# EAGLE design cmv_s (EAGLE 9.6.2)
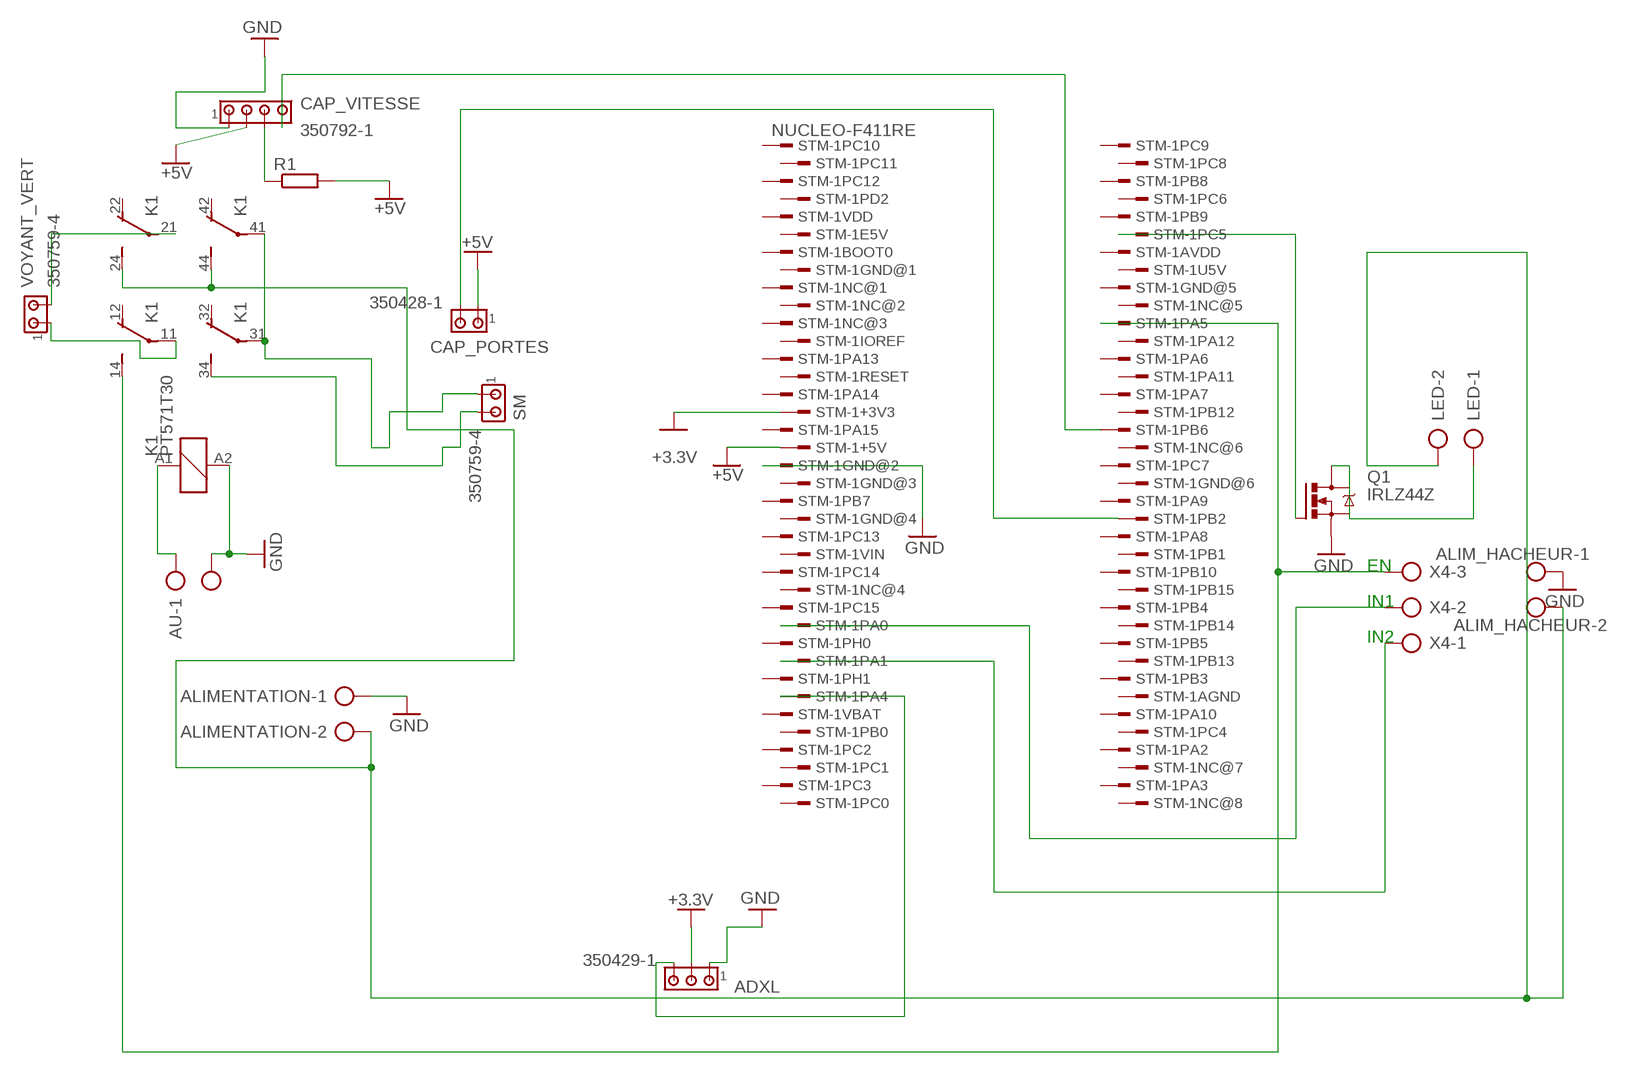
[diagram p0: schematic, sheet 1]

## Parts
ADXL  350429-1  [350429-1]
ALIM_HACHEUR  AK300/2  [AK300/2]
ALIMENTATION  AK300/2  [AK300/2]
AU  AK300/2  [AK300/2]
CAP_PORTES  350428-1  [350428-1]
CAP_VITESSE  350792-1  [350792-1]
K1  PT571T30  [PT-4]
LED  AK300/2  [AK300/2]
Q1  IRLZ44Z  [TO220BH]
R1  R-EU_0204/7  [0204/7]
SM  350759-4  [350759-4]
STM-1  NUCLEO-F411RE  [CONN_STM32_NUCLEO]
VOYANT_VERT  350759-4  [350759-4]
X4  AK300/3  [AK300/3]

## Nets
+3.3V: ADXL.2 STM-1.16
+5V: CAP_PORTES.1 CAP_VITESSE.2 R1.2 STM-1.18
GND: ADXL.1 ALIM_HACHEUR.1 ALIMENTATION.1 AU.2 CAP_VITESSE.1 K1.A2 Q1.S STM-1.19
N$1: AU.1 K1.A1
N$2: K1.34(4:S) SM.2
N$3: K1.11(2:P) VOYANT_VERT.1
N$4: LED.1 Q1.D
N$5: CAP_VITESSE.3 R1.1
N$6: K1.21(3:P) VOYANT_VERT.2
N$7: CAP_PORTES.2 STM-1.60
N$8: K1.31(4:P) K1.41(5:P) SM.1
N$9: CAP_VITESSE.4 STM-1.55
N$10: ADXL.3 STM-1.32
N$11: Q1.G STM-1.44
N$12: ALIM_HACHEUR.2 ALIMENTATION.2 K1.24(3:S) K1.44(5:S) LED.2
N$13: K1.14(2:S) STM-1.49 X4.3
N$14: STM-1.28 X4.2
N$15: STM-1.30 X4.1
Unconnected: K1.12(2:O) K1.22(3:O) K1.32(4:O) K1.42(5:O) STM-1.1 STM-1.2 STM-1.3 STM-1.4 STM-1.5 STM-1.6 STM-1.7 STM-1.8 STM-1.9 STM-1.10 STM-1.11 STM-1.12 STM-1.13 STM-1.14 STM-1.15 STM-1.17 STM-1.20 STM-1.21 STM-1.22 STM-1.23 STM-1.24 STM-1.25 STM-1.26 STM-1.27 STM-1.29 STM-1.31 STM-1.33 STM-1.34 STM-1.35 STM-1.36 STM-1.37 STM-1.38 STM-1.39 STM-1.40 STM-1.41 STM-1.42 STM-1.43 STM-1.45 STM-1.46 STM-1.47 STM-1.48 STM-1.50 STM-1.51 STM-1.52 STM-1.53 STM-1.54 STM-1.56 STM-1.57 STM-1.58 STM-1.59 STM-1.61 STM-1.62 STM-1.63 STM-1.64 STM-1.65 STM-1.66 STM-1.67 STM-1.68 STM-1.69 STM-1.70 STM-1.71 STM-1.72 STM-1.73 STM-1.74 STM-1.75 STM-1.76

## Notes on the sheet
- EN
- IN1
- IN2

## Library data of the parts
ADXL = con-amp:350429-1: Universal MATE-N-LOK .250" Centerline, 600 V, 19 - 36 A max Source: http://catalog.tycoelectronics.com/ .. ENG_CD_350429_Y.pdf
ALIM_HACHEUR ALIMENTATION AU LED = con-ptr500:AK300/2: CONNECTOR; OC_FARNELL: unknown; OC_NEWARK: unknown
CAP_PORTES = con-amp:350428-1: Universal MATE-N-LOK .250" Centerline, 600 V, 19 - 36 A max Source: http://catalog.tycoelectronics.com/ .. ENG_CD_350428_Y.pdf
CAP_VITESSE = con-amp:350792-1: Universal MATE-N-LOK .250" Centerline, 600 V, 19 - 36 A max Source: http://catalog.tycoelectronics.com/ .. ENG_CD_350792_R.pdf
K1 = relay:PT5*: Miniature Relay SCHRACK 2 pole 12 A, 3 pole 10 A or 4 pole 6 A DC- or AC-coil Source: http://www.schrack.com/.. 5823.pdf Socked 78604 Source: http://www.schrack.com/.. 5836.pdf; OC_FARNELL: unknown; OC_NEWARK: unknown
Q1 = transistor-power:IRLZ44Z: N-Channel HEXFET® Power MOSFET Logic Level AUTOMOTIVE MOSFET Source: http://www.irf.com/product-info/datasheets/data/irlz44zpbf.pdf
R1 = rcl:R-EU_: RESISTOR, European symbol; SPICEPREFIX: R
SM VOYANT_VERT = con-amp:350759-4: Universal MATE-N-LOK .250" Centerline, 600 V, 19 - 36 A max Source: http://catalog.tycoelectronics.com/ .. ENG_CD_350759_R.pdf
STM-1 = prj-ips-jmb:NUCLEO-F411RE
X4 = con-ptr500:AK300/3: CONNECTOR; OC_FARNELL: unknown; OC_NEWARK: unknown

## Board
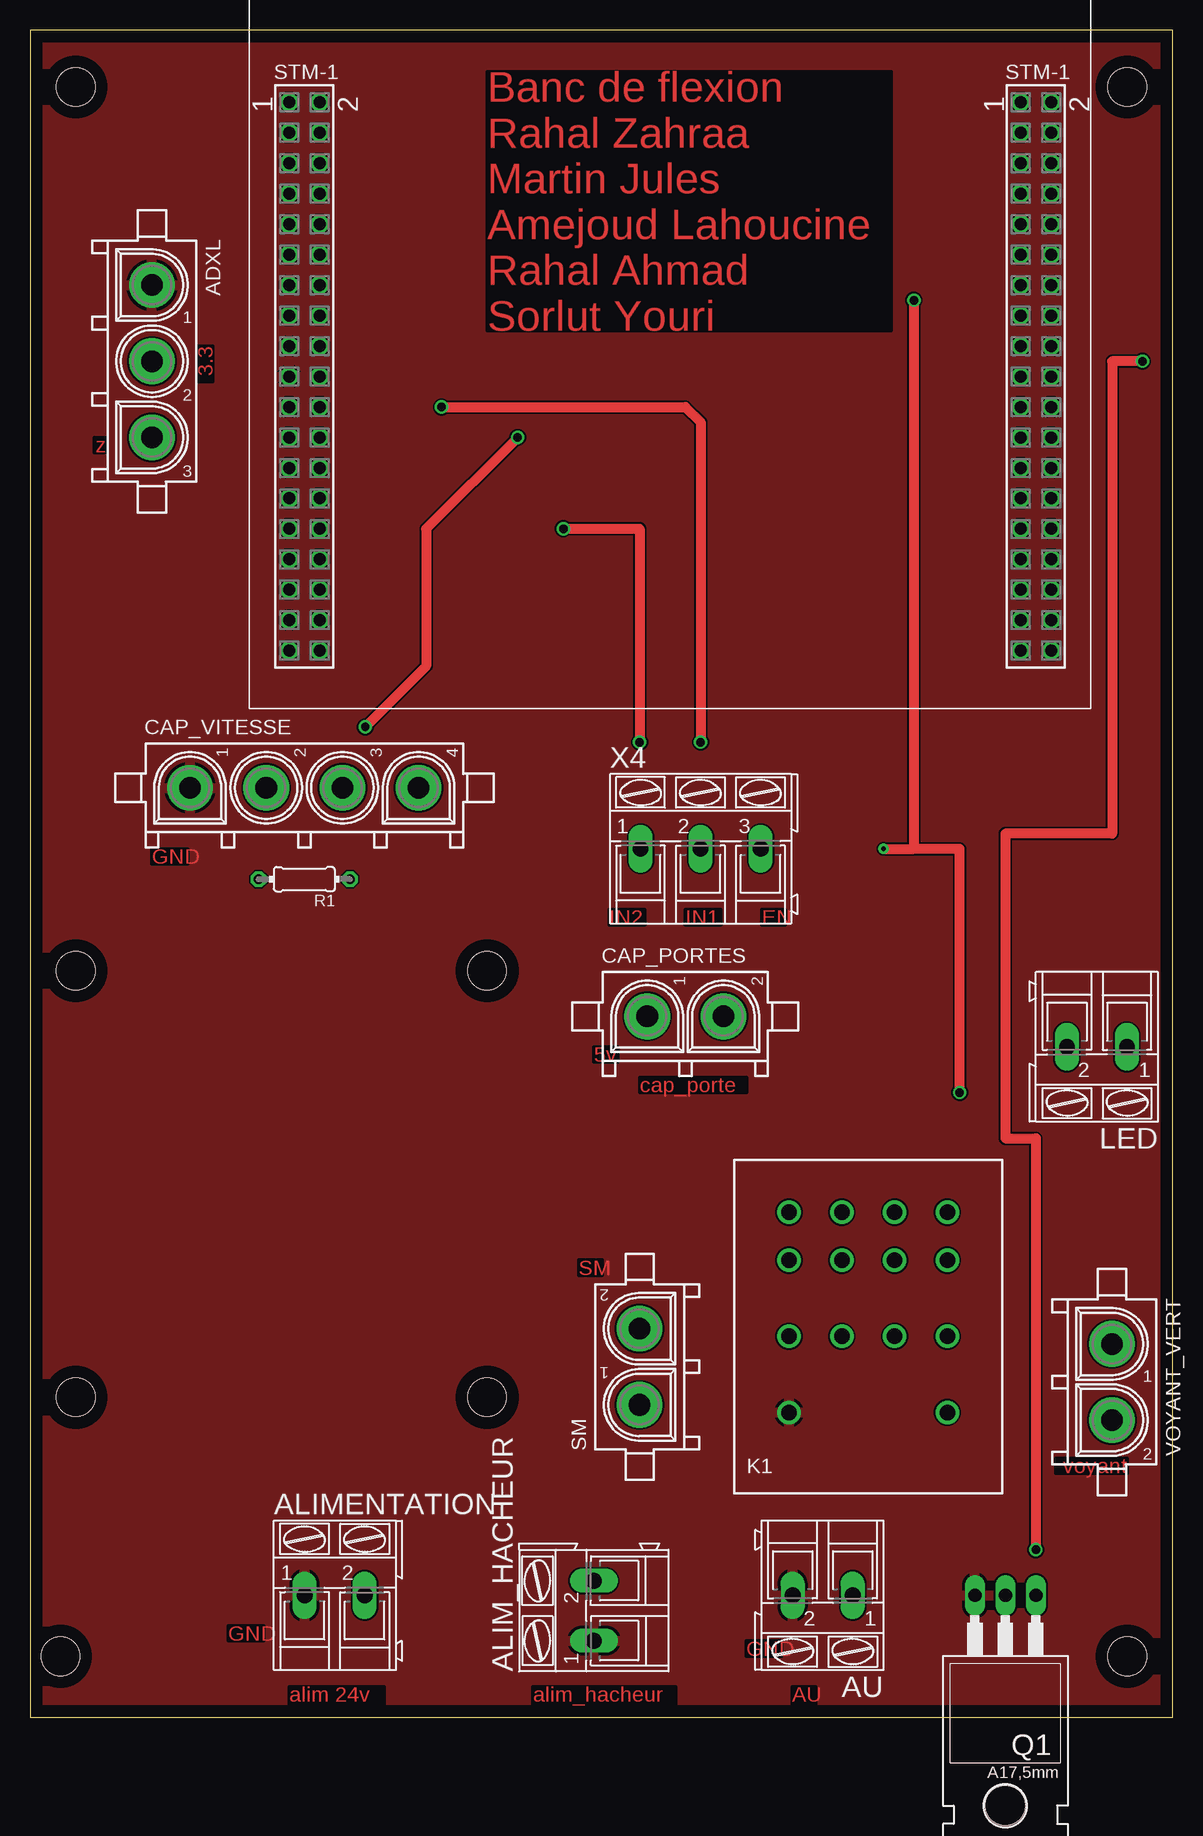
[diagram p1: board, top side]
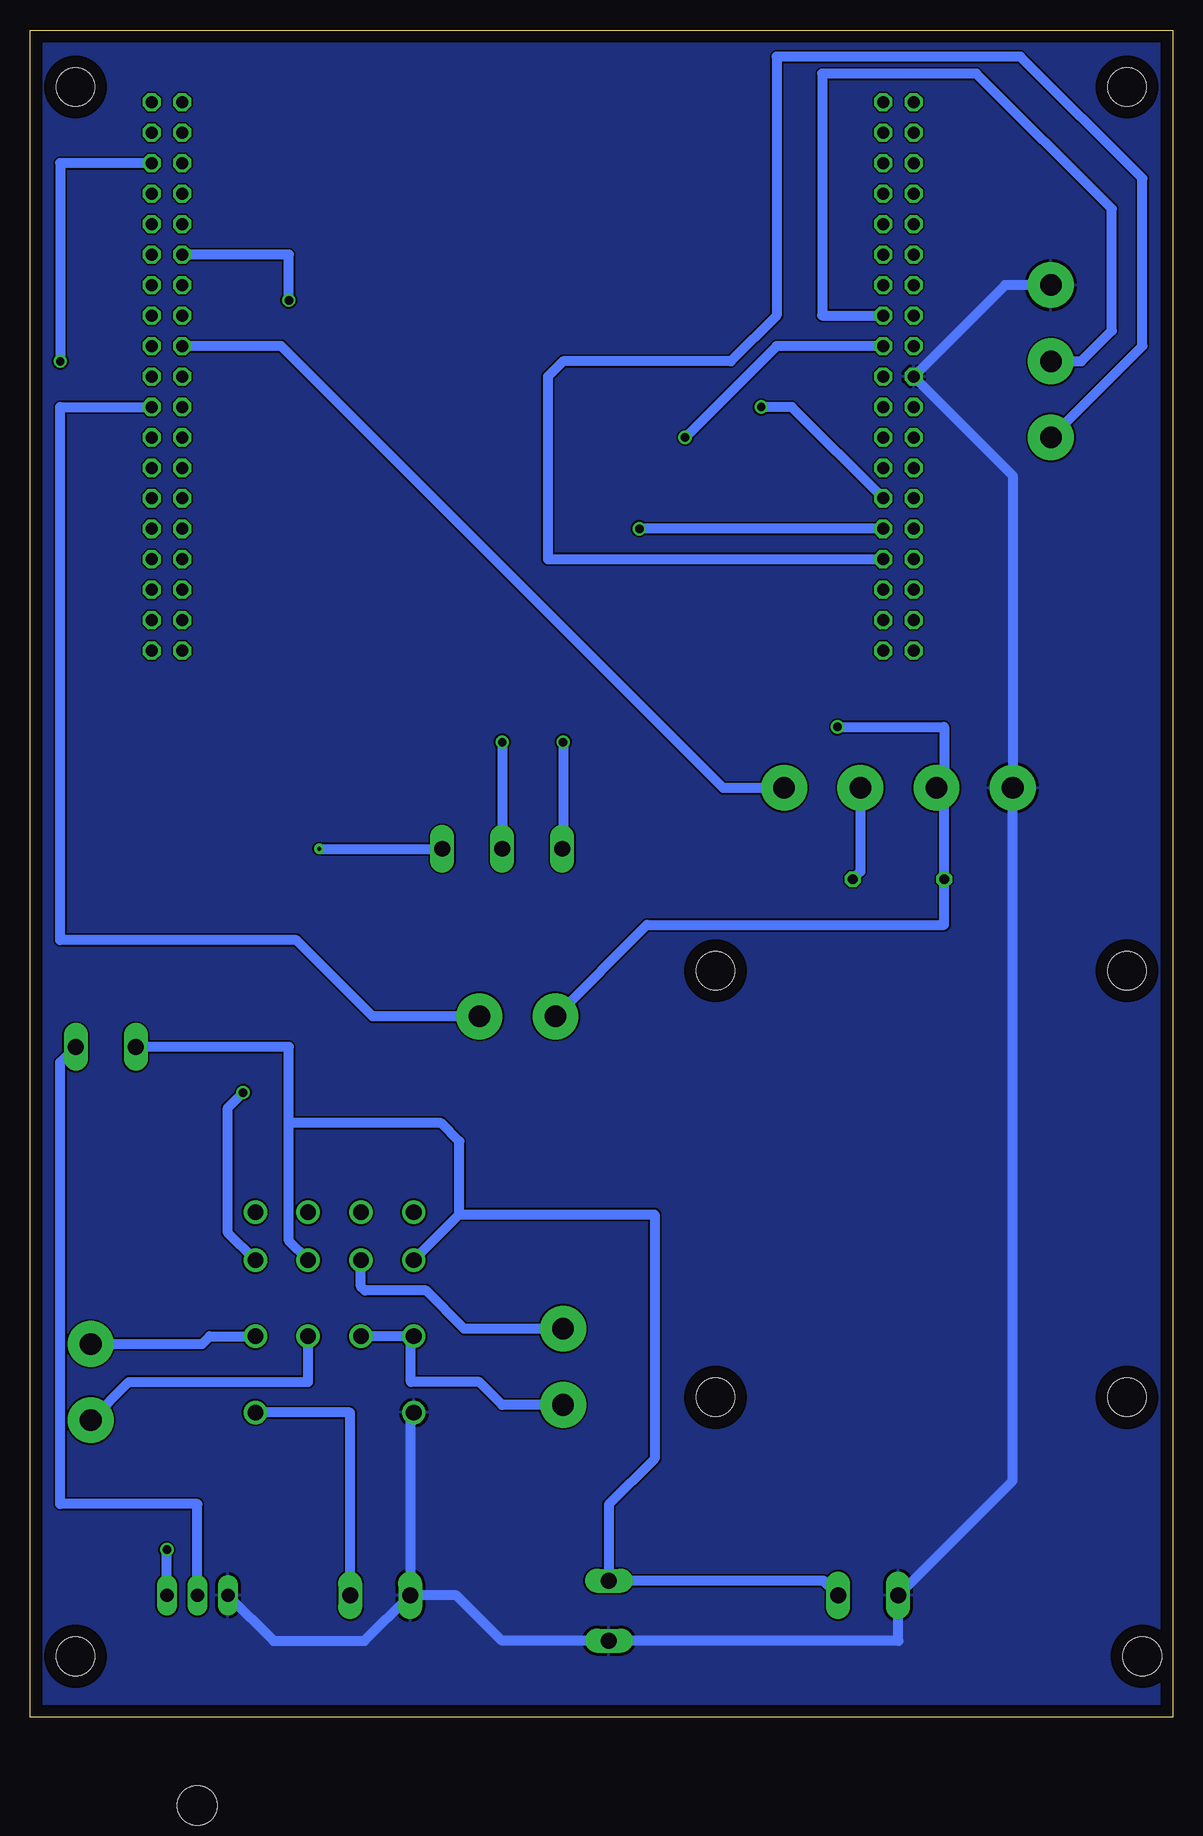
[diagram p2: board, bottom side, seen from below]

Size 95.23 x 140.64 mm. Coordinates in mm from the lower left corner, seen from the top.
Outline: 0,0 95.23,0 95.23,140.64 0,140.64 0,0
Copper layers (1*16): Top 0.035mm / dielectric 1.5mm / Bottom 0.035mm
Design rules "default": minimum track width 6mil, minimum drill 0.35mm, track to track 6mil, track to pad 6mil, pad to pad 6mil, via to via 6mil, smd to smd 6mil, copper to edge 40mil, drill to drill 6mil, minimum pad ring 10mil, minimum via ring 8mil, stop-mask expansion 4mil, vias tented up to drill 0mil, thermal gap 10mil
Holes 3.2 mm at 38.1,62.23 3.81,62.23 3.81,26.67 38.1,26.67 3.81,135.89 2.54,5.08 91.44,135.89 91.44,5.08

### Footprints (pad centres in the part's own frame; a part is rotated, then mirrored left to right if it is on the bottom)
350429-1 = drill 1.8 pad 3.81: 1 -6.35,0; 2 0,0; 3 6.35,0
AK300/2 = drill 1.321 long: 1 -2.515,0; 2 2.489,0
350428-1 = drill 1.8 pad 3.81: 1 -3.175,0; 2 3.175,0
350792-1 = drill 1.8 pad 3.81: 1 -9.525,0; 2 -3.175,0; 3 3.175,0; 4 9.525,0
PT-4 = drill 1.3: 11 6.6,6.35; 12 6.6,16.7; 14 6.6,12.7; 21 2.2,6.35; 22 2.2,16.7; 24 2.2,12.7; 31 -2.2,6.35; 32 -2.2,16.7; 34 -2.2,12.7; 41 -6.6,6.35; 42 -6.6,16.7; 44 -6.6,12.7; A1 6.6,0; A2 -6.6,0
TO220BH = drill 1.118 long: D 0,-6.35; G -2.54,-6.35; S 2.54,-6.35 | hole 3.302: 0,11.176
0204/7 = drill 0.813 octagon: 1 -3.81,0; 2 3.81,0
350759-4 = drill 1.8 pad 3.81: 1 -3.175,0; 2 3.175,0
CONN_STM32_NUCLEO = drill 1 pad 1.5 octagon: 1 -1.27,22.86; 2 1.27,22.86; 3 -1.27,20.32; 4 1.27,20.32; 5 -1.27,17.78; 6 1.27,17.78; 7 -1.27,15.24; 8 1.27,15.24; 9 -1.27,12.7; 10 1.27,12.7; 11 -1.27,10.16; 12 1.27,10.16; 13 -1.27,7.62; 14 1.27,7.62; 15 -1.27,5.08; 16 1.27,5.08; 17 -1.27,2.54; 18 1.27,2.54; 19 -1.27,0; 20 1.27,0; 21 -1.27,-2.54; 22 1.27,-2.54; 23 -1.27,-5.08; 24 1.27,-5.08; 25 -1.27,-7.62; 26 1.27,-7.62; 27 -1.27,-10.16; 28 1.27,-10.16; 29 -1.27,-12.7; 30 1.27,-12.7; 31 -1.27,-15.24; 32 1.27,-15.24; 33 -1.27,-17.78; 34 1.27,-17.78; 35 -1.27,-20.32; 36 1.27,-20.32; 37 -1.27,-22.86; 38 1.27,-22.86; 39 59.69,22.86; 40 62.23,22.86; 41 59.69,20.32; 42 62.23,20.32; 43 59.69,17.78; 44 62.23,17.78; 45 59.69,15.24; 46 62.23,15.24; 47 59.69,12.7; 48 62.23,12.7; 49 59.69,10.16; 50 62.23,10.16; 51 59.69,7.62; 52 62.23,7.62; 53 59.69,5.08; 54 62.23,5.08; 55 59.69,2.54; 56 62.23,2.54; 57 59.69,0; 58 62.23,0; 59 59.69,-2.54; 60 62.23,-2.54; 61 59.69,-5.08; 62 62.23,-5.08; 63 59.69,-7.62; 64 62.23,-7.62; 65 59.69,-10.16; 66 62.23,-10.16; 67 59.69,-12.7; 68 62.23,-12.7; 69 59.69,-15.24; 70 62.23,-15.24; 71 59.69,-17.78; 72 62.23,-17.78; 73 59.69,-20.32; 74 62.23,-20.32; 75 59.69,-22.86; 76 62.23,-22.86
AK300/3 = drill 1.321 long: 1 -5.004,0; 2 0,0; 3 5.004,0

### Placement (x,y rotation side)
ADXL  10.16,113.03 270 top
ALIM_HACHEUR  46.99,8.89 90 top
ALIMENTATION  25.4,10.16 0 top
AU  66.04,10.16 180 top
CAP_PORTES  54.61,58.42 0 top
CAP_VITESSE  22.86,77.47 0 top
K1  69.85,25.4 0 top
LED  88.9,55.88 180 top
Q1  81.28,3.81 180 top
R1  22.86,69.85 180 top
SM  50.8,29.21 90 top
STM-1  22.86,111.76 0 top
VOYANT_VERT  90.17,27.94 270 top
X4  55.88,72.39 0 top

### Tracks (layer width: path | path; a pad name or v marks a point on that pad's centre or on a via)
+3.3V
  Bottom 0.813: ADXL.2 7.62,113.03 5.08,115.57 5.08,125.73 16.36,137.01 29.21,137.01 29.21,116.84 STM-1.16
+5V  (via drill 0.7 pad 0.85)
  Top 0.813: v40.64,106.68 33.02,99.06 33.02,87.63 v27.94,82.55
  Bottom 0.813: 19.37,77.15 19.05,76.84 R1.2 19.05,66.04 43.81,66.04 CAP_PORTES.1 | 19.37,77.15 CAP_VITESSE.2 | STM-1.18 33.02,114.3 v40.64,106.68 | v27.94,82.55 19.05,82.55 19.05,77.47 19.37,77.15
GND
  Bottom 0.813: ADXL.1 13.97,119.38 STM-1.19 13.34,103.51 CAP_VITESSE.1 13.34,19.71 ALIMENTATION.1 22.86,10.13 22.86,6.35 22.89,6.38 ALIM_HACHEUR.1 55.9,6.38 59.69,10.16 AU.2 | K1.A2 63.55,25.1 AU.2 | Q1.S 74.93,6.35 67.36,6.35 AU.2
  pour Bottom: 0,140.97 96.52,140.97 96.52,-1.27 0,-1.27 -1.27,0 -1.27,139.7
  pour Top: -1.91,140.97 -1.91,-1.27 97.79,-1.27 97.79,140.97
N$1
  Bottom 0.813: AU.1 68.56,25.38 68.58,25.4 K1.A1
N$2
  Bottom 0.813: SM.2 59.05,32.38 62.23,35.56 67.31,35.56 67.65,35.9 K1.34
N$3
  Bottom 0.813: VOYANT_VERT.1 80.9,31.11 80.26,31.75 K1.11
N$4
  Bottom 0.813: Q1.D 81.28,17.78 92.71,17.78 92.71,54.59 LED.1
N$5
  Bottom 0.813: CAP_VITESSE.3 26.04,70.48 R1.1
N$6
  Bottom 0.813: VOYANT_VERT.2 87,27.94 72.05,27.94 K1.21
N$7
  Bottom 0.813: STM-1.60 92.71,109.22 92.71,64.77 73.03,64.77 66.67,58.42 CAP_PORTES.2
N$8
  Bottom 0.813: SM.1 55.88,26.04 57.78,27.94 63.5,27.94 63.5,31.5 K1.41 K1.31
N$9
  Bottom 0.813: CAP_VITESSE.4 37.46,77.47 74.3,114.3 STM-1.55
N$10
  Bottom 0.813: ADXL.3 2.54,114.3 2.54,128.27 12.7,138.43 33.02,138.43 33.02,116.84 36.83,113.03 50.8,113.03 52.07,111.76 52.07,96.52 STM-1.32
N$11  (via drill 0.7 pad 0.85)
  Top 0.813: v92.71,113.03 90.17,113.03 90.17,73.66 81.28,73.66 81.28,48.26 83.82,48.26 v83.82,13.97
  Bottom 0.813: STM-1.44 92.71,129.54 v92.71,113.03 | Q1.G v83.82,13.97
N$12
  Bottom 0.813: K1.24 73.66,39.71 73.66,49.53 | LED.2 73.66,55.88 73.66,49.53 | ALIMENTATION.2 29.11,11.38 ALIM_HACHEUR.2 46.99,17.73 43.18,21.54 43.18,41.91 59.44,41.91 | K1.44 59.44,41.91 | 59.44,41.91 59.44,48.01 60.96,49.53 73.66,49.53
N$13  (via drill 0.35 pad 0.85, 0.7 pad 0.85)
  Top 0.813: v77.47,52.07 77.47,72.39 73.66,72.39 | v73.66,118.11 73.66,72.39 | v71.12,72.39 73.66,72.39
  Bottom 0.813: v77.47,52.07 78.74,50.8 78.74,40.39 K1.14 | v73.66,118.11 73.66,121.92 STM-1.49 | v71.12,72.39 X4.3
N$14  (via drill 0.7 pad 0.85)
  Top 0.813: v34.29,109.22 54.61,109.22 55.88,107.95 v55.88,81.28
  Bottom 0.813: STM-1.28 31.75,109.22 v34.29,109.22 | v55.88,81.28 X4.2
N$15  (via drill 0.7 pad 0.85)
  Top 0.813: v44.45,99.06 50.8,99.06 v50.8,81.28
  Bottom 0.813: STM-1.30 v44.45,99.06 | v50.8,81.28 50.8,72.47 X4.1

### Text on the board
Top: Banc de flexion / Rahal Zahraa / Martin Jules / Amejoud Lahoucine / Rahal Ahmad / Sorlut Youri | 3.3 | z | GND | IN2 | IN1 | EN | 5v | cap_porte | SM | voyant | GND | GND | alim 24v | alim_hacheur | AU